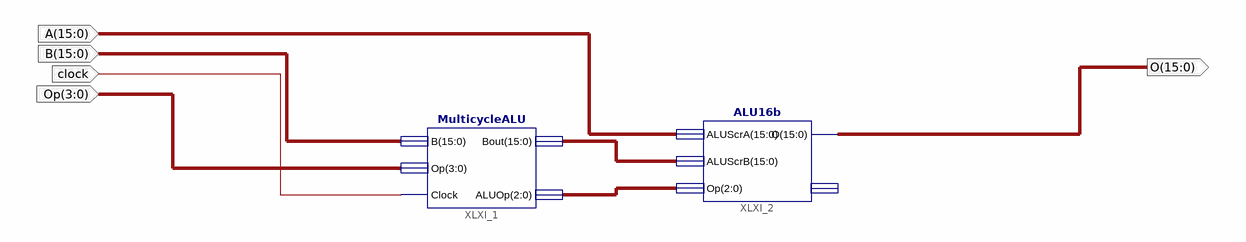
[diagram p0: schematic sheet 1]
// Xilinx ISE schematic ALUcomp.sch (spartan3e) as structural Verilog: 2 symbols, 5 ports
module ALUcomp (
  input  [15:0] A,
  input  [15:0] B,
  input  clock,
  input  [3:0] Op,
  output [15:0] O
);

  wire [2:0] XLXN_7;
  wire [15:0] XLXN_1;

  MulticycleALU XLXI_1 (.B(B), .Op(Op), .Clock(clock), .Bout(XLXN_1), .ALUOp(XLXN_7));
  ALU16b XLXI_2 (.ALUScrA(A), .ALUScrB(XLXN_1), .Op(XLXN_7), .O(O));  // open: zero
endmodule
